# Altium schematic sheet Sheet1.SchDoc
size A4; SheetNumber: 1; SheetTotal: 1
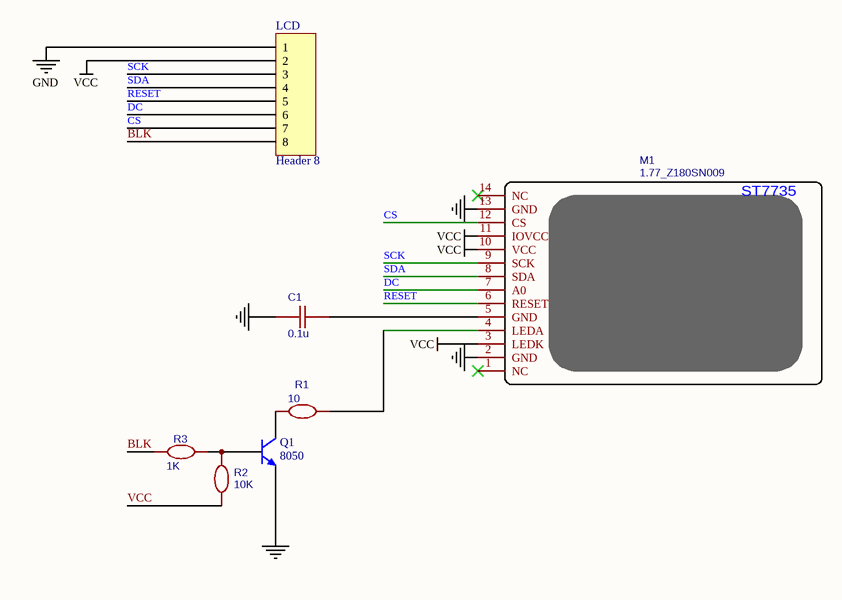
[diagram p0: Sheet1.SchDoc]

## Parts
C1  0.1u  [0603]
LCD  Header 8  [HDR1X8]
M1  1.77_Z180SN009  [PCBComponent_1]
Q1  8050  [PCBComponent_1 - duplicate]
R1  10  [0603]
R2  10K  [0603]
R3  1K  [0603]

## Nets
GND: C1.2 LCD.1 M1.2(GND) M1.13(GND) Q1.1(E)
VCC: LCD.2 M1.3(LEDK) M1.10(VCC) M1.11(IOVCC) R2.1
BLK: LCD.8 R3.2
CS: LCD.7 M1.12(CS)
DC: LCD.6 M1.7(A0)
RESET: LCD.5 M1.6(RESET)
SCK: LCD.3 M1.9(SCK)
SDA: LCD.4 M1.8(SDA)
NetC1_1: C1.1 M1.5(GND)
NetM1_4: M1.4(LEDA) R1.2
NetQ1_2: Q1.2(B) R2.2 R3.1
NetQ1_3: Q1.3(C) R1.1

Not connected (* = marked no-connect by the designer): M1 1(NC)* 14(NC)*

## Notes on the sheet
- (in symbol 1.77_Z180SN009) ST7735

## Library data of the parts
C1 = 0.1u: nameAlias: Value(F); Contributor: LCEDA_Lib; spicePre: C; spiceSymbolName: C_0402_US
LCD = Header 8: Header, 8-Pin; LatestRevisionDate: 17-Jul-2002; LatestRevisionNote: Re-released for DXP Platform.; Publisher: Altium Limited
M1 = 1.77_Z180SN009: Contributor: 私有工程; spicePre: M; spiceSymbolName: 1.77_Z180SN009
Q1 = 2N3904: NPN General Purpose Amplifier; Published: 8-Jun-2000; LatestRevisionDate: 15-Jan-2003; LatestRevisionNote: PCB Footprint 'BCY-W3/D4.7' replaced; DatasheetVersion: 1997; PackageVersion: Sep-1998; PackageReference: TO-92A; Publisher: Altium Limited; PackageDescription: TO, Flat Index; 3 In-Line, Axial Leads; Body Dia. 4.5mm; Leads 0.51 x 0.48 mm (max); ComponentLink1Description: Manufacturer Link; ComponentLink1URL: http://www.fairchildsemi.com/; ComponentLink2Description: Datasheet; ComponentLink2URL: http://www.fairchildsemi.com/ds/2N%2F2N3904.pdf
R1 = 180R: nameAlias: Value(Ω); Contributor: LCEDA_Lib; spicePre: R; spiceSymbolName: R_0603_EU
R2 = 0R/10K: nameAlias: Value(Ω); Contributor: LCEDA_Lib; spicePre: R; spiceSymbolName: R_0603_EU
R3 = 470R: nameAlias: Value(Ω); Contributor: LCEDA_Lib; spicePre: R; spiceSymbolName: R_0603_EU